# Altium schematic sheet Channel .SchDoc
size A4
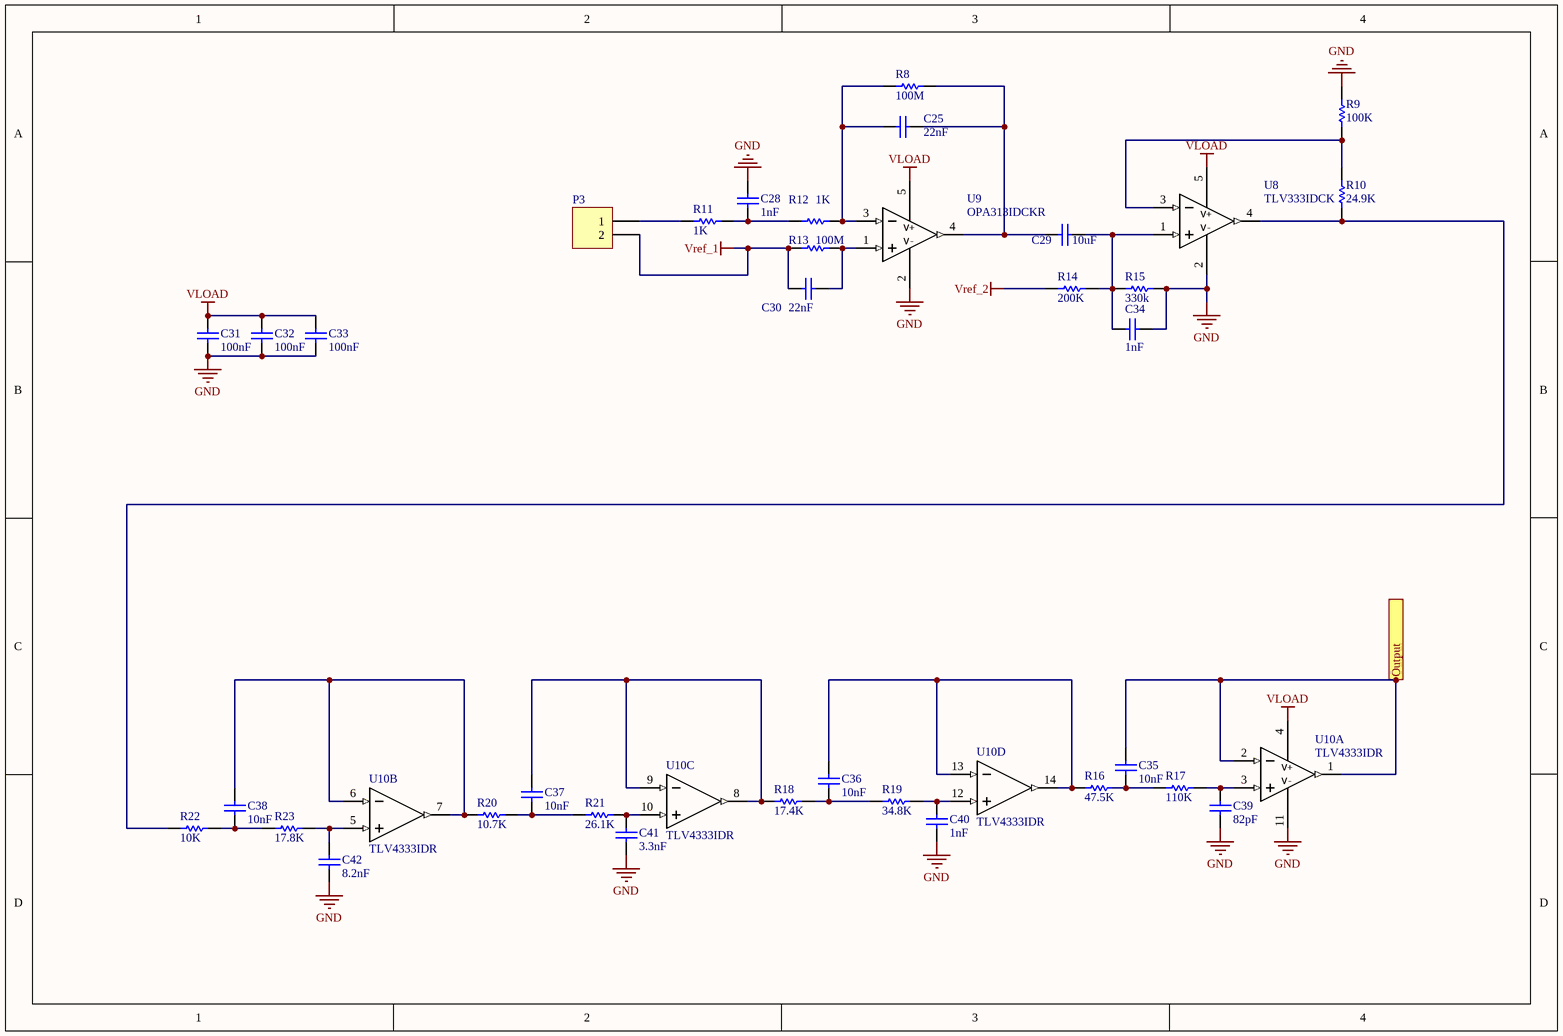
[diagram p0: Channel .SchDoc]

## Parts
C25  22nF  [S0805C]
C28  1nF  [S0603C]
C29  10uF  [S0805C]
C30  22nF  [S0805C]
C31  100nF  [S0603C]
C32  100nF  [S0603C]
C33  100nF  [S0603C]
C34  1nF  [S0603C]
C35  10nF  [S0603C]
C36  10nF  [S0603C]
C37  10nF  [S0603C]
C38  10nF  [S0603C]
C39  82pF  [S0603C]
C40  1nF  [S0603C]
C41  3.3nF  [S0603C]
C42  8.2nF  [S0603C]
P3  Header 2  [CP1X2]  (value not drawn)
R8  100M  [S0805R]
R9  100K  [S0603R]
R10  24.9K  [S0603R]
R11  1K  [S0603R]
R12  1K  [S0603R]
R13  100M  [S0805R]
R14  200K  [S0603R]
R15  330k  [S0603R]
R16  47.5K  [S0603R]
R17  110K  [S0603R]
R18  17.4K  [S0603R]
R19  34.8K  [S0603R]
R20  10.7K  [S0603R]
R21  26.1K  [S0603R]
R22  10K  [S0603R]
R23  17.8K  [S0603R]
U8  TLV333IDCK  [DCK0005A_N]
U9  OPA313IDCKR  [DCK0005A_N]
U10  TLV4333IDR  [D14]  (parts A,B,C,D of 4)

## Ports
Output

## Nets
GND: C28.2 C31.2 C32.2 C33.2 C34.1 C39.1 C40.2 C41.1 C42.1 R9.2 R15.2 U8.2(V-) U9.2(V-) U10.11(V-)
VLOAD: C31.1 C32.1 C33.1 U8.5(V+) U9.5(V+) U10.4(V+)
Vref_1: C30.2 P3.2 R13.1
Vref_2: R14.1
Output: C35.2 U10.1(OUT) U10.2(IN-) ; port Output
NetC25_1: C25.1 C29.2 R8.2 U9.4(OUT)
NetC25_2: C25.2 R8.1 R12.2 U9.3(IN-)
NetC28_1: C28.1 R11.2 R12.1
NetC29_1: C29.1 C34.2 R14.2 R15.1 U8.1(IN+)
NetC30_1: C30.1 R13.2 U9.1(IN+)
NetC35_1: C35.1 R16.2 R17.1
NetC36_1: C36.1 R18.2 R19.1
NetC36_2: C36.2 R16.1 U10.13(IN-) U10.14(OUT)
NetC37_1: C37.1 R20.2 R21.1
NetC37_2: C37.2 R18.1 U10.8(OUT) U10.9(IN-)
NetC38_1: C38.1 R22.2 R23.1
NetC38_2: C38.2 R20.1 U10.6(IN-) U10.7(OUT)
NetC39_2: C39.2 R17.2 U10.3(IN+)
NetC40_1: C40.1 R19.2 U10.12(IN+)
NetC41_2: C41.2 R21.2 U10.10(IN+)
NetC42_2: C42.2 R23.2 U10.5(IN+)
NetP3_1: P3.1 R11.1
NetR9_1: R9.1 R10.2 U8.3(IN-)
NetR10_1: R10.1 R22.1 U8.4(OUT)

## Library data of the parts
C25 C30 = 22nF/0805/50V: 精度 ±5% / 容值 22nF / 额定电压 50V / 温漂系数（介质材料) C0G; Manufacturer: TDK; A_Manufacturer: 元六; Code: C2012C0G1H223JT000N; A_Code: J CC41-0805-CG-50V-223J; CompType: Capacitor; A_ComType: 一类类电容; DistributorCode: C342593; Package: 0805
C28 C34 C40 = 1nF/0603/50V: 精度 ±5% / 容值 1nF / 额定电压 50V / 温漂系数（介质材料) C0G; Manufacturer: FH(风华); A_Manufacturer: 元六; Code: 0603CG102J500NT; A_Code: J CC41-0603-CG-50V-102J; CompType: Capacitor; DistributorCode: C1636; Package: 0603
C29 = 10uF/0805/16V: 精度 ±10% / 容值 10uF / 额定电压 16V / 温漂系数（介质材料) X7R; Manufacturer: FH(风华); A_Manufacturer: 元六; Code: 0805B106K160NT; A_Code: J CT41-0805-2R2-16V-106M; CompType: Capacitor; A_ComType: 二类电容; DistributorCode: C92341; Package: 0805
C31-C33 = 100nF/0603/50V: 精度 ±10% / 容值 100nF / 额定电压 50V / 温漂系数（介质材料) X7R; Manufacturer: FH(风华); A_Manufacturer: 元六; Code: 0603B104K500NT; A_Code: J CT41-0603-2R1-50V-104K; CompType: Capacitor; A_ComType: 二类电容; DistributorCode: C30926; Package: 0603
C35-C38 = 10nF/0603/C0G/50V: 精度 ±5% / 容值 10nF / 额定电压 50V / 温漂系数（介质材料) C0G; Manufacturer: FH(风华); A_Manufacturer: 元六; Code: 0603CG103J500NT; A_Code: J CC41-0603-CG-50V-103J; CompType: Capacitor; DistributorCode: C82282; Package: 0603
C39 = 82pF/0603/C0G/50V: 精度 ±5% / 容值 82pF / 额定电压 50V / 温漂系数（介质材料) C0G; Manufacturer: FH(风华); A_Manufacturer: 元六; Code: 0603CG820J500NT; A_Code: J CC41-0603-CG-50V-820J; CompType: Capacitor; DistributorCode: C1683; Package: 0603
C41 = 3.3nF/0603/50V: 精度 ±5% / 容值 3.3nF / 额定电压 50V / 温漂系数（介质材料) C0G; Manufacturer: FH(风华); A_Manufacturer: 元六; Code: 0603CG332J500NT; A_Code: J CC41-0603-CG-50V-332J; CompType: Capacitor; DistributorCode: C190576; Package: 0603
C42 = 8.2nF/0603/C0G: 精度 ±5% / 容值 8.2nF / 额定电压 50V / 温漂系数（介质材料) C0G; Manufacturer: TDK; A_Manufacturer: 元六; Code: C1608C0G1H822JT000N; A_Code: J CC41-0603-CG-50V-822J; CompType: Capacitor; DistributorCode: C445716; Package: 0603
P3 = Header 2: Header, 2-Pin; Code: -; CompType: -; DistributorCode: -; Manufacturer: -; Package: -; A_Code: -; A_ComType: -; A_Manufacturer: -
R8 R13 = 100M/0805: 精度 ±1% / 温度系数 ±100ppm/℃ / 功率 0.125W; Manufacturer: UNI-ROYAL(厚声); A_Manufacturer: 718; Code: 0805W8F1006T5E; A_Code: J-RM2012(0805)-K-B-100M-F; CompType: Resistor; DistributorCode: C169373; Package: 0805
R9 = 100K/0603: 精度 ±1% / 阻值 100kΩ / 温度系数 ±100ppm/℃ / 功率 0.1W; Manufacturer: FH(风华); A_Manufacturer: 718; Code: RS-03K1003FT; A_Code: J-RM1608(0603)-K-B-100K-F; CompType: Resistor; A_ComType: RM型片式膜固定电阻器; DistributorCode: C115320; Package: 0603
R10 = 24.9K/0603: 精度 ±1% / 温度系数 ±100ppm/℃ / 阻值 24.9kΩ / 功率 0.1W; Manufacturer: FH(风华); A_Manufacturer: 718; Code: RS-03K2492FT; A_Code: J-RM1608(0603)-K-B-24.9K-F; CompType: Resistor; DistributorCode: C321809; Package: 0603
R11 R12 = 1K/0603: 精度 ±1% / 温度系数 ±100ppm/℃ / 阻值 1kΩ / 功率 0.1W; Manufacturer: FH(风华); A_Manufacturer: 718; Code: RS-03K1001FT; A_Code: J-RM1608(0603)-K-B-1K-F; CompType: Resistor; A_ComType: RM型片式膜固定电阻器; DistributorCode: C115325; Package: 0603
R14 = 200K/0603: 精度 ±1% / 温度系数 ±100ppm/℃ / 功率 0.1W / 阻值 200kΩ; Manufacturer: FH(风华); A_Manufacturer: 718; Code: RS-03K2003FT; A_Code: J-RM1608(0603)-K-B-200K-F; CompType: Resistor; DistributorCode: C95331; Package: 0603
R15 = 330K/0603: 精度 ±1% / 温度系数 ±100ppm/℃ / 功率 0.1W; Manufacturer: FH(风华); A_Manufacturer: 718; Code: RS-03K3303FT; A_Code: J-RM1608(0603)-K-B-330K-F; CompType: Resistor; DistributorCode: C286584; Package: 0603
R16 = 47.5K/0603: 精度 ±1% / 阻值 47.5kΩ / 温度系数 ±100ppm/℃ / 功率 0.1W; Manufacturer: FH(风华); A_Manufacturer: 718; Code: RS-03K4752FT; A_Code: J-RM1608(0603)-K-B-47.5K-F; CompType: Resistor; A_ComType: RM型片式膜固定电阻器; DistributorCode: C321924; Package: 0603
R17 = 110K/0603: 精度 ±1% / 温度系数 ±100ppm/℃ / 功率 0.1W / 阻值 110kΩ; Manufacturer: FH(风华); A_Manufacturer: 718; Code: RS-03K1103FT; A_Code: J-RM1608(0603)-K-B-107K-F; CompType: Resistor; A_ComType: RM型片式膜固定电阻器; DistributorCode: C304689; Package: 0603
R18 = 17.4K/0603: 精度 ±1% / 温度系数 ±100ppm/℃ / 阻值 17.4kΩ / 功率 0.1W; Manufacturer: FH(风华); A_Manufacturer: 718; Code: RS-03K1742FT; A_Code: J-RM1608(0603)-K-B-17.4K-F; CompType: Resistor; DistributorCode: C304711; Package: 0603
R19 = 34.8K/0603: 精度 ±1% / 阻值 34.8kΩ / 温度系数 ±100ppm/℃ / 功率 0.1W; Manufacturer: FH(风华); A_Manufacturer: 718; Code: RS-03K3482FT; A_Code: J-RM1608(0603)-K-B-34.8K-F; CompType: Resistor; DistributorCode: C321868; Package: 0603
R20 = 10.7K/0603: 精度 ±1% / 温度系数 ±100ppm/℃ / 阻值 10.7kΩ / 功率 0.1W; Manufacturer: FH(风华); A_Manufacturer: 718; Code: RS-03K1072FT; A_Code: J-RM1608(0603)-K-B-10.7K-F; CompType: Resistor; DistributorCode: C321678; Package: 0603
R21 = 26.1K/0603: 精度 ±1% / 温度系数 ±100ppm/℃ / 功率 0.1W / 阻值 26.1kΩ; Manufacturer: FH(风华); A_Manufacturer: 718; Code: RS-03K2612FT; A_Code: J-RM1608(0603)-K-B-26.1K-F; CompType: Resistor; DistributorCode: C321818; Package: 0603
R22 = 10K/0603: 精度 ±1% / 温度系数 ±100ppm/℃ / 阻值 10kΩ / 功率 0.1W; Manufacturer: FH(风华); A_Manufacturer: 718; Code: RS-03K1002FT; A_Code: J-RM1608(0603)-K-B-10K-F; CompType: Resistor; A_ComType: RM型片式膜固定电阻器; DistributorCode: C115324; Package: 0603
R23 = 17.8K/0603: 精度 ±1% / 温度系数 ±100ppm/℃ / 功率 0.1W; Manufacturer: FH(风华); A_Manufacturer: 718; Code: RS-03K1782FT; A_Code: J-RM1608(0603)-K-B-17.8K-F; CompType: Resistor; DistributorCode: C310271; Package: 0603
U8 = TLV333IDCK: 电源电压 1.8V ~ 5.5V, ±0.9V ~ 2.75V / 增益带宽积（GBP） 350kHz / 压摆率（SR） 0.16 V/us / 工作温度 -40°C ~ 125°C /; Manufacturer: TI(德州仪器); CompType: 运放; DistributorCode: C181502; Package: SC-70-5; Code: TLV333IDCK; A_Code: -; A_Manufacturer: -; A_ComType: -
U9 = OPA313IDCKR: 增益带宽积（GBP） 1MHz / 放大器组数 1 / 输出类型 Rail-to-Rail / 运放类型 General Purpose / 各通道功耗 50uA / 压摆率（SR） 0.5 V/us / 工作温度 -40°C ~ 125°C / 电源电压 1.8V ~ 5.5V; Manufacturer: TI(德州仪器); CompType: 运放; DistributorCode: C129150; Package: SC-70-5; Code: OPA313IDCKR; A_Code: -; A_Manufacturer: -; A_ComType: -
U10 = TLV4333IDR: 电源电压 1.8V ~ 5.5V, ±0.9V ~ 2.75V / 增益带宽积（GBP） 350kHz / 压摆率（SR） 0.16 V/us / 工作温度 -40°C ~ 125°C; Manufacturer: TI(德州仪器); CompType: 运放; DistributorCode: C140298; Package: SOIC-14; Code: TLV4333IDR